# Altium schematic sheet Nav_Ducer_ADC.SchDoc
size A
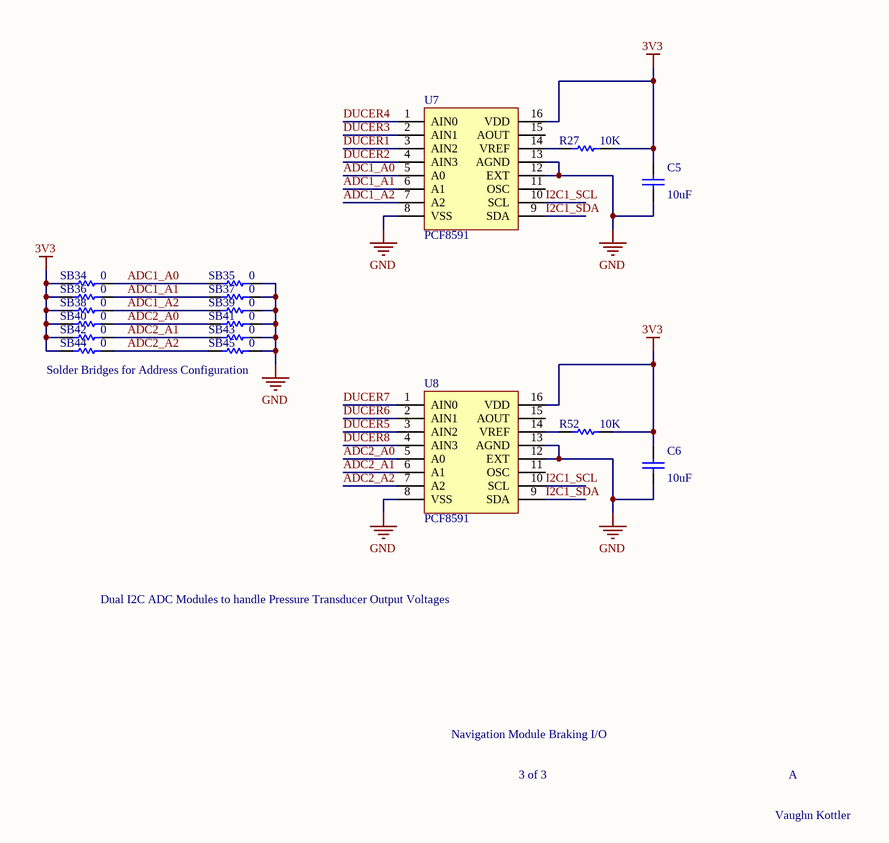
[diagram p0: Nav_Ducer_ADC.SchDoc]

## Parts
C5  value 10uF  [C1206]  (hidden comment: Cap)
C6  value 10uF  [C1206]  (hidden comment: Cap)
R27  value 10K  [6-0805_M]  (hidden comment: Res1)
R52  value 10K  [6-0805_M]  (hidden comment: Res1)
SB34  value 0  [6-0805_M]  (hidden comment: Res1)
SB35  value 0  [6-0805_M]  (hidden comment: Res1)
SB36  value 0  [6-0805_M]  (hidden comment: Res1)
SB37  value 0  [6-0805_M]  (hidden comment: Res1)
SB38  value 0  [6-0805_M]  (hidden comment: Res1)
SB39  value 0  [6-0805_M]  (hidden comment: Res1)
SB40  value 0  [6-0805_M]  (hidden comment: Res1)
SB41  value 0  [6-0805_M]  (hidden comment: Res1)
SB42  value 0  [6-0805_M]  (hidden comment: Res1)
SB43  value 0  [6-0805_M]  (hidden comment: Res1)
SB44  value 0  [6-0805_M]  (hidden comment: Res1)
SB45  value 0  [6-0805_M]  (hidden comment: Res1)
U7  PCF8591  [16-SOIC]
U8  PCF8591  [16-SOIC]

## Nets
3V3: C5.2 C6.2 R27.1 R52.1 SB34.2 SB36.2 SB38.2 SB40.2 SB42.2 SB44.2 U7.16(VDD) U8.16(VDD)
GND: C5.1 C6.1 SB35.1 SB37.1 SB39.1 SB41.1 SB43.1 SB45.1 U7.8(VSS) U7.12(EXT) U7.13(AGND) U8.8(VSS) U8.12(EXT) U8.13(AGND)
ADC1_A0: SB34.1 SB35.2 U7.5(A0)
ADC1_A1: SB36.1 SB37.2 U7.6(A1)
ADC1_A2: SB38.1 SB39.2 U7.7(A2)
ADC2_A0: SB40.1 SB41.2 U8.5(A0)
ADC2_A1: SB42.1 SB43.2 U8.6(A1)
ADC2_A2: SB44.1 SB45.2 U8.7(A2)
DUCER1: U7.3(AIN2)
DUCER2: U7.4(AIN3)
DUCER3: U7.2(AIN1)
DUCER4: U7.1(AIN0)
DUCER5: U8.3(AIN2)
DUCER6: U8.2(AIN1)
DUCER7: U8.1(AIN0)
DUCER8: U8.4(AIN3)
I2C1_SCL: U7.10(SCL) U8.10(SCL)
I2C1_SDA: U7.9(SDA) U8.9(SDA)
NetR27_2: R27.2 U7.14(VREF)
NetR52_2: R52.2 U8.14(VREF)

Not connected (* = marked no-connect by the designer): U7 11(OSC) 15(AOUT); U8 11(OSC) 15(AOUT)

## Notes on the sheet
- Solder Bridges for Address Configuration
- Dual I2C ADC Modules to handle Pressure Transducer Output Voltages
- Navigation Module Braking I/O
- 3 of 3
- A
- Vaughn Kottler

## Library data of the parts
C5 C6 = Cap: Capacitor; Published: 8-Jun-2000; LatestRevisionDate: 17-Jul-2002; LatestRevisionNote: Re-released for DXP Platform.; PackageReference: RAD-0.3; Publisher: Altium Limited; PackageDescription: Radial Cap, Thru-Hole; 2 Leads; 0.3 in Pin Spacing
R27 R52 SB34-SB45 = Res1: Resistor; Published: 8-Jun-2000; LatestRevisionDate: 17-Jul-2002; LatestRevisionNote: Re-released for DXP Platform.; PackageReference: AXIAL-0.3; Publisher: Altium Limited; PackageDescription: Axial Device, Thru-Hole; 2 Leads; 0.3 in Pin Spacing
U7 U8 = PCF8591: 8-bit A/D and D/A; ComponentLink1Description: Part; ComponentLink1URL: https://www.digikey.com/product-detail/en/nxp-usa-inc/PCF8591T-2518/568-1088-1-ND/735798; ComponentLink2Description: Datasheet; ComponentLink2URL: https://www.nxp.com/docs/en/data-sheet/PCF8591.pdf